# Altium schematic sheet maindoline.SchDoc
size A
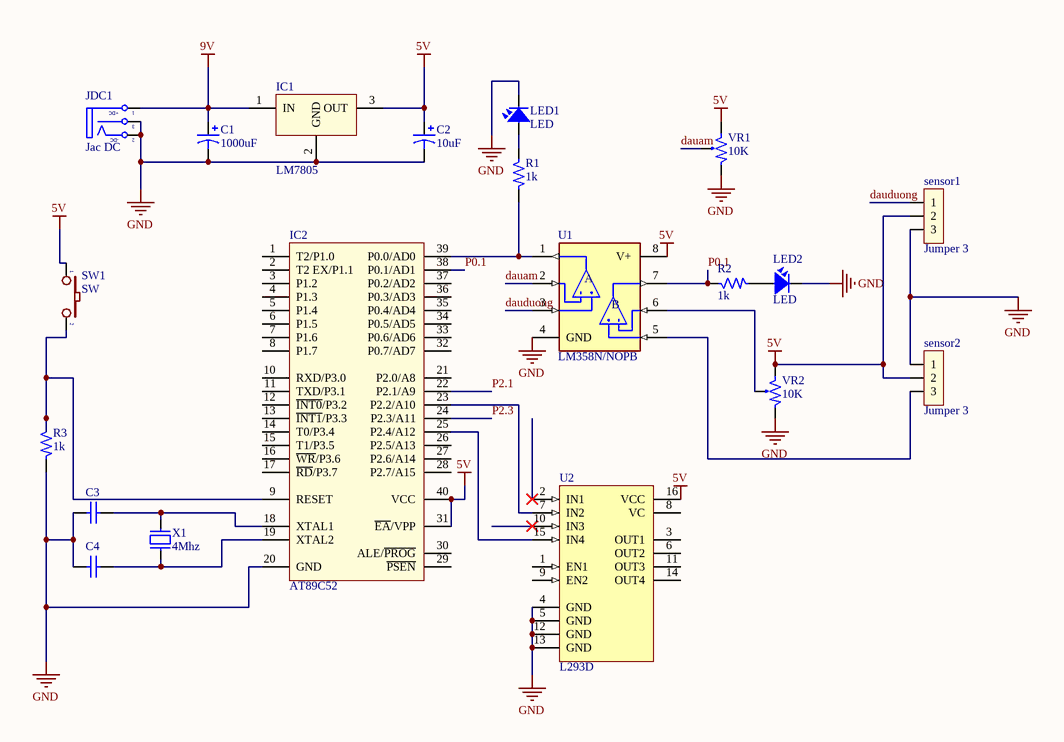
[diagram p0: maindoline.SchDoc]

## Parts
C1  1000uF  [C5mm]
C2  10uF  [C5mm]
C3  22pF  [C0805]  (value not drawn)
C4  22pF  [C0805]  (value not drawn)
IC1  LM7805  [QTO-220]
IC2  AT89C52  [DIP40/W0.6]
JDC1  Jac DC  [DC-IN]
LED1  LED  [LED-3]
LED2  LED  [LED-3]
R1  1k  [RES-SMD-0805]
R2  1k  [RES-SMD-0805]
R3  1k  [RES-SMD-0805]
sensor1  Jumper 3  [JP3]
sensor2  Jumper 3  [JP3]
SW1  SW  [SW2]
U1  LM358N/NOPB  [DIP794W45P254L959H508Q8]
U2  L293D  [DIP880W50P254L2000H510Q16]
VR1  10K  [VR]
VR2  10K  [VR]
X1  4Mhz  [XT2]

## Nets
5V: C2.1 IC1.3(OUT) IC2.31(~{EA}/VPP) IC2.40(VCC) sensor1.2 sensor2.2 SW1.1 U1.8(V+) U2.16(VCC) VR1.3 VR2.3
9V: C1.1 IC1.1(IN) JDC1.1(T)
GND: C1.2 C2.2 C3.1 C4.1 IC1.2(GND) IC2.20(GND) JDC1.2(TN) JDC1.3(S) LED1.2 LED2.2 R3.2 sensor1.3 sensor2.1 U1.4(GND) U2.4(GND) U2.5(GND) U2.12(GND) U2.13(GND) VR1.1 VR2.1
dauam: U1.2(-INA) VR1.2
dauduong: sensor1.1 U1.3(+INA)
P0.1: IC2.38(P0.1/AD1) R2.1 U1.7(OUTB)
P2.1: IC2.22(P2.1/A9)
P2.3: IC2.24(P2.3/A11)
NetC3_2: C3.2 IC2.18(XTAL1) X1.1
NetC4_2: C4.2 IC2.19(XTAL2) X1.2
NetIC2_9: IC2.9(RESET) R3.1 SW1.2
NetIC2_23: IC2.23(P2.2/A10) U2.7(IN2)
NetIC2_25: IC2.25(P2.4/A12) U2.15(IN4)
NetIC2_39: IC2.39(P0.0/AD0) R1.2 U1.1(OUTA)
NetLED1_1: LED1.1 R1.1
NetLED2_1: LED2.1 R2.2
Netsensor2_3: sensor2.3 U1.5(+INB)
NetU1_6: U1.6(-INB) VR2.2

Not connected (* = marked no-connect by the designer): IC2 1(T2/P1.0) 2(T2_EX/P1.1) 3(P1.2) 4(P1.3) 5(P1.4) 6(P1.5) 7(P1.6) 8(P1.7) 10(RXD/P3.0) 11(TXD/P3.1) 12(~{INT0}/P3.2) 13(~{INT1}/P3.3) 14(T0/P3.4) 15(T1/P3.5) 16(~{WR}/P3.6) 17(~{RD}/P3.7) 21(P2.0/A8) 26(P2.5/A13) 27(P2.6/A14) 28(P2.7/A15) 29(~{PSEN}) 30(ALE/~{PROG}) 32(P0.7/AD7) 33(P0.6/AD6) 34(P0.5/AD5) 35(P0.4/AD4) 36(P0.3/AD3) 37(P0.2/AD2); U2 1(EN1) 2(IN1)* 3(OUT1) 6(OUT2) 8(VC) 9(EN2) 10(IN3)* 11(OUT3) 14(OUT4)

## Notes on the sheet
- (in symbol DCIN) +DC; -DC
- (in symbol LM358N/NOPB) A; B

## Library data of the parts
C1 C2 = Cap Pol 5mm: Polarized Capacitor (Axial); Published: 8-Jun-2000; LatestRevisionDate: 17-Jul-2002; LatestRevisionNote: Re-released for DXP Platform.; PackageReference: POLAR0.8; Publisher: Altium Limited
C3 C4 = CapSMD: Capacitor; Value: 33p; Published: 8-Jun-2000; LatestRevisionDate: 17-Jul-2002; LatestRevisionNote: Re-released for DXP Platform.; PackageReference: RAD-0.3; Publisher: Altium Limited
IC1 = LM78xx: On ap +, from + 5 to + 24VDC; Value: LM7805
IC2 = AT89C52: Atmel AT89C52, 8k Byte Flash Memory , 40 Pin; Value: AT89C52
JDC1 = DCIN: Jac DC input; Value: Jac DC
LED1 LED2 = LED: LED Single colour Green and Red; Value: LED 3 ly Single Colour
R1-R3 = R: Resistor 1/4W; Value: R1/4W - 1K
sensor1 sensor2 = JP3: Value: J3
SW1 = SW2: Switch button 2 pin; Value: SW chip 2 pin
U1 = LM358N/NOPB: <a href="https://snapeda.com/parts/LM358N/NOPB/Texas%20Instruments/view-part/?ref=eda">Check prices</a>; Price: None; MP: LM358N/NOPB; Value: *; Availability: Unavailable; Package: None
U2 = L293D: Push-Pull Four Channel Driver With Diode; Published: 8-Jun-2000; LatestRevisionDate: 06-Jun-2005; LatestRevisionNote: Stylized 3D Model Added.; DatasheetVersion: Jun-1996; PackageVersion: Apr-1996; PackageReference: DIP16; Publisher: Altium Limited; PackageDescription: DIP; 16 Leads; Row Spacing 7.62 mm; Pitch 2.54 mm; ComponentLink1Description: Manufacturer Link; ComponentLink1URL: http://www.st.com/; ComponentLink2Description: Datasheet; ComponentLink2URL: http://www.st.com/stonline/products/literature/ds/1330/l293d.pdf
VR1 VR2 = VR1: Var Resistor; Value: VR 10K
X1 = XT2: Crystal For all Crystal 2pin.; Value: 4Mhz